# EAGLE design Adafruit BMP180 (EAGLE 6.3)
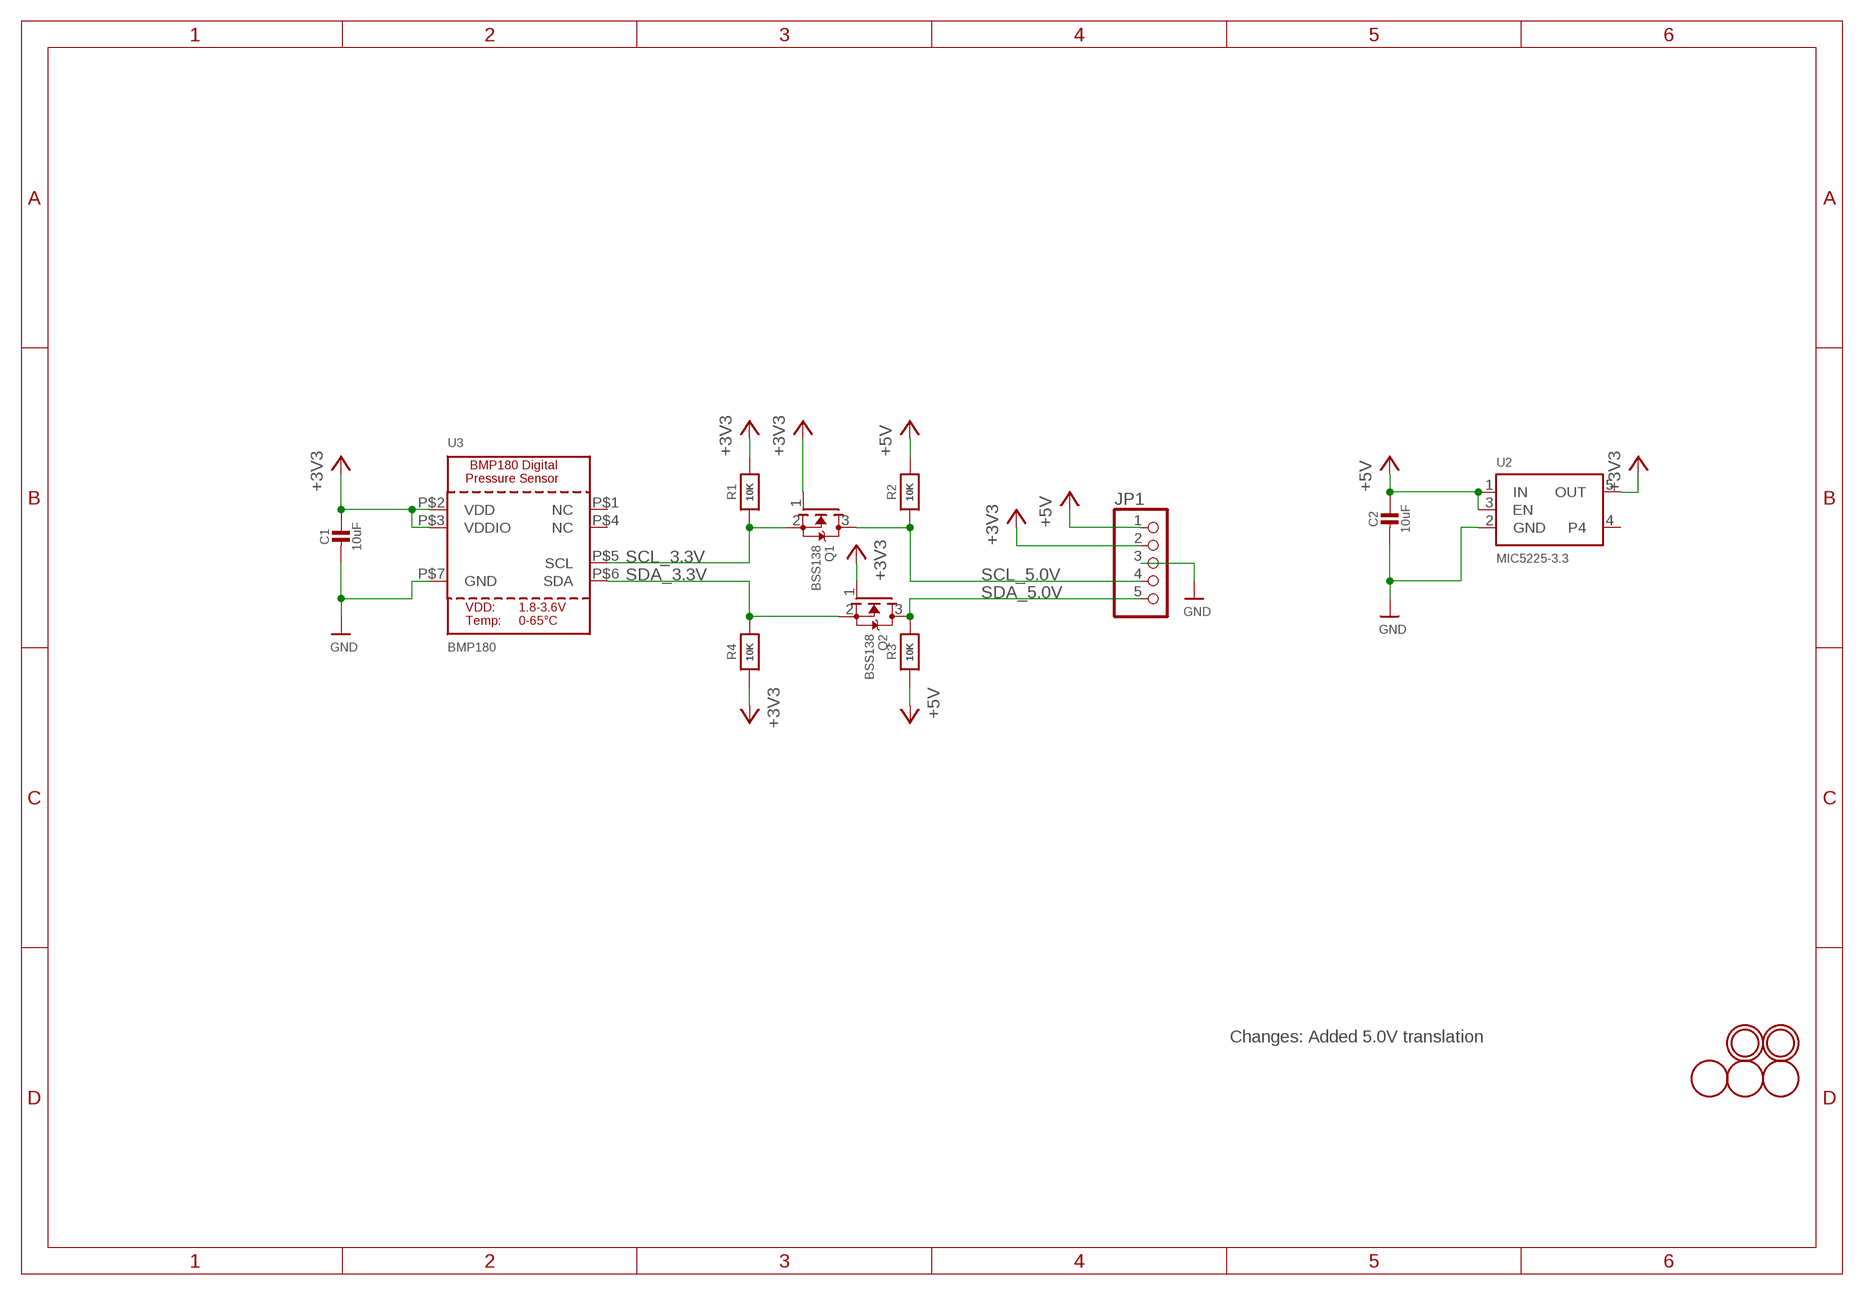
[diagram p0: schematic, sheet 1]

## Parts
C1  10uF  CAP_CERAMIC0805-NOOUTLINE  [0805-NO]
C2  10uF  CAP_CERAMIC0805-NOOUTLINE  [0805-NO]
JP1  HEADER-1X570MIL  [1X05_ROUND_70]
Q1  BSS138  MOSFET-NREFLOW  [SOT23]
Q2  BSS138  MOSFET-NREFLOW  [SOT23]
R1  10K  RESISTOR0805_NOOUTLINE  [0805-NO]
R2  10K  RESISTOR_0805MP  [_0805MP]
R3  10K  RESISTOR0805_NOOUTLINE  [0805-NO]
R4  10K  RESISTOR0805_NOOUTLINE  [0805-NO]
U2  MIC5225-3.3  VREG_SOT23-5  [SOT23-5]
U3  BMP180  BMP180EXT  [BMP180_EXTENDED]
U$1  FIDUCIAL  [FIDUCIAL_1MM]
U$5  FIDUCIAL  [FIDUCIAL_1MM]
U$7  MOUNTINGHOLE2.0  [MOUNTINGHOLE_2.0_PLATED]
U$8  MOUNTINGHOLE2.0  [MOUNTINGHOLE_2.0_PLATED]
U$15  FIDUCIAL  [FIDUCIAL_1MM]

## Nets
+3V3: C1.1 JP1.2 Q1.1(G) Q2.1(G) R1.2 R4.1 U2.5(OUT) U3.P$2(VDD) U3.P$3(VDDIO)
+5V: C2.1 JP1.1 R2.2 R3.1 U2.1(IN) U2.3(EN)
GND: C1.2 C2.2 JP1.3 U2.2(GND) U3.P$7(GND)
SCL_3.3V: Q1.2(S) R1.1 U3.P$5(SCL)
SCL_5.0V: JP1.4 Q1.3(D) R2.1
SDA_3.3V: Q2.2(S) R4.2 U3.P$6(SDA)
SDA_5.0V: JP1.5 Q2.3(D) R3.2
Unconnected: U2.4 U3.P$1(NC) U3.P$4(NC)

## Notes on the sheet
- Changes: Added 5.0V translation

## Library data of the parts
C1 C2 = microbuilder:CAP_CERAMIC: Ceramic Capacitors For new designs, use the packages preceded by an '_' character since they are more reliable: The following footprints should be used on most boards: _0402 - Standard footprint for regular board layouts _0603 - Standard footprint for regular board layouts _0805 - Standard footprint for regular board layouts _1206 - Standard footprint for regular board layouts For extremely tight-pitch boards where space is at a premium, the following 'micro-pitch' footprints can be used (smaller pads, no silkscreen outline, etc.): _0402MP - Micro-pitch footprint for very dense/compact boards _0603MP - Micro-pitch footprint for very dense/compact boards _0805MP - Micro-pitch footprint for very dense/compact boards _1206MP - Micro-pitch footprint for very dense/compact boards
JP1 = microbuilder:HEADER-1X5: PIN HEADER
Q1 Q2 = adafruit:MOSFET-N: N-Channel Mosfet 2N7002E - 60V 260mA SOT23 [Digikey: 2N7002ET1GOSTR-ND] - REEL BSH103 - 30V 850mA SOT23 [Digikey: 568-5013-1-ND]
R1-R4 = microbuilder:RESISTOR: Resistors For new designs, use the packages preceded by an '_' character since they are more reliable: The following footprints should be used on most boards: _0402 - Standard footprint for regular board layouts _0603 - Standard footprint for regular board layouts _0805 - Standard footprint for regular board layouts _1206 - Standard footprint for regular board layouts For extremely tight-pitch boards where space is at a premium, the following 'micro-pitch' footprints can be used (smaller pads, no silkscreen outline, etc.): _0402MP - Micro-pitch footprint for very dense/compact boards _0603MP - Micro-pitch footprint for very dense/compact boards _0805MP - Micro-pitch footprint for very dense/compact boards _1206MP - Micro-pitch footprint for very dense/compact boards
U2 = microbuilder:VREG_SOT23-5: SOT23-5 Fixed Voltage Regulators Part Current Out V Out V In V Dropout θJA (°C/W) TJ (°C) Digikey Part No. ADP121 150mA 3.3V 3.4-5.5V 0.09V @ 150mA -- -- ADP121-AUJZ33R7CT-ND ADP121 150mA 3.0V 3.1-5.5V 0.09V @ 150mA -- -- ADP121-AUJZ30R7CT-ND ADP122 300mA 3.3V 3.4-5.5V 0.085V @ 300mA -- -- ADP122AUJZ-3.3-R7CT-ND ADP1712 300mA 3.3V 3.5-5.5V 0.17V @ 300mA -- -- ADP1712AUJZ-3.3-R7TR-ND AP7311 (Low Cost) 150mA 3.3V 3.5-6V 0.15V @ 150mA -- -- AP7311-33WG-7DICT-ND LD39015M18R 150mA 1.8V 1.9V-5.5V 0.08V @ 100mA -- -- 497-6977-1-ND LP2985A-33DBVR 150mA 3.3V 3.3-16V 0.28V @ 150mA 206 150 296-18479-1-ND MCP1824T-3302E/OT 300mA 3.3V 3.5V-6V 0.2V @ 300mA -- -- MCP1824T-3302E/OTCT-ND MIC5205-2.5YM5 TR 150mA 2.5V 2.7-16V 0.165V @ 150mA -- -- 576-1257-2-ND MIC5205-3.0YM5 TR 150mA 3.0V 3.2V-16V 0.165V @ 150mA -- -- 576-1258-2-ND MIC5205-3.3YM5 TR 150mA 3.3V 3.5V-16V 0.165V @ 150mA -- -- 576-1259-2-ND TPS780330220 150mA 3.3V+2.2V 3.6-5.5V 250mV Max -- -- 296-23332-1-ND TDA3663/N1,135 100mA 3.3V 3.5-45V 0.18V @ 50mA -- -- 568-5343-1-ND Max operating temp can be calculated using θJA, TJ (max junction temperature), and power in watts. Set the "Maximum Ambient Temperature" until it reaches TJ ("Max Junction Temperature"), which is the absolute limit for safe use of the regulator: Heat Sink Temperature Calculator <http://www.daycounter.com/Calculators/Heat-Sink-Temperature-Calculator.phtml> For example, With 12V source into a 3.3V LP2985 and a 30mA load, we are dissipating (12V-3.3V) * 0.03A = 0.261W. With a θJA of 206 °C/W, a TJ of 150°C, and 261mW we can safely use the chip without a heat sink up to 75°C (=147.1°C Junction Temperature).
U3 = microbuilder:BMP180: BMP180 Digital Pressure Sensor 1.8-3.6V Supply, I2C Interface
U$1 U$5 U$15 = adafruit:FIDUCIAL: For use by pick and place machines to calibrate the vision/machine, 1mm By microbuilder.eu
U$7 U$8 = microbuilder:MOUNTINGHOLE: Mounting Hole For #2 screws (0.086"/2.18mm width, 0.094"/2.4mm hole) use 2.5mm; BOM: EXCLUDE

## Board
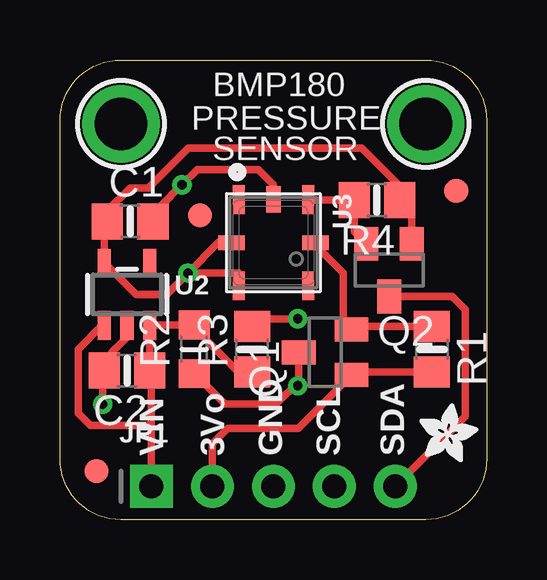
[diagram p1: board, top side]
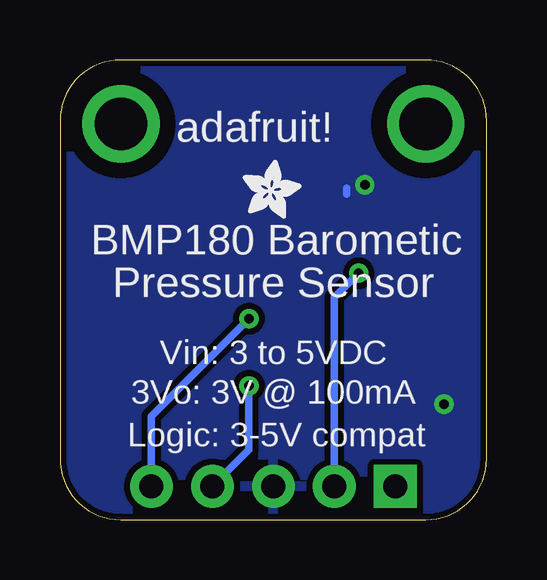
[diagram p2: board, bottom side, seen from below]

Size 17.78 x 19.18 mm. Coordinates in mm from the lower left corner, seen from the top.
Outline: 15.24,0 2.54,0 arc-90 0,2.54 0,16.64 arc-90 2.54,19.18 15.24,19.18 arc-90 17.78,16.64 17.78,2.54 arc-90 15.24,0
Copper layers (1*16): Top 0.035mm / dielectric 1.5mm / Bottom 0.035mm
Design rules "adafruit *": minimum track width 8mil, minimum drill 15.5mil, track to track 8mil, track to pad 8mil, pad to pad 8mil, via to via 8mil, smd to smd 8mil, copper to edge 10mil, drill to drill 8mil, minimum pad ring 10mil, minimum via ring 8mil, stop-mask expansion 4mil, vias tented up to drill 20mil, thermal gap 10mil

### Footprints (pad centres in the part's own frame; a part is rotated, then mirrored left to right if it is on the bottom)
0805-NO = smd 1.3 x 1.5: 1 -0.95,0; 2 0.95,0
1X05_ROUND_70 = drill 1 pad 1.778 square: 1 -5.08,0 | drill 1 pad 1.778: 2 -2.54,0; 3 0,0; 4 2.54,0; 5 5.08,0
SOT23 = smd 1 x 1.4: 1 -0.95,-1.1; 2 0.95,-1.1; 3 0,1.1
_0805MP = smd 1.2 x 1.3: 1 -1.016,0; 2 1.016,0
SOT23-5 = smd 0.55 x 1.2: 1 -0.95,-1.3; 2 0,-1.3; 3 0.95,-1.3; 4 0.95,1.3; 5 -0.95,1.3
BMP180_EXTENDED = smd 1.2 x 0.5: P$1 -1.8,-1.45; P$3 1.8,-1.45; P$4 1.8,1.45; P$6 -1.8,1.45 | smd 0.6 x 1.1: P$2 0,-1.75; P$5 0,1.75 | smd 1.1 x 0.6: P$7 -1.8,0
FIDUCIAL_1MM = smd 1 x 1: 1 0,0
MOUNTINGHOLE_2.0_PLATED = drill 2.2 pad 3: P$1 0,0

### Placement (x,y rotation side)
C1  2.92,12.45 0 top
C2  2.79,6.22 180 top
JP1  8.89,1.4 0 top
Q1  11.05,6.99 90 top
Q2  13.72,10.41 180 top
R1  15.49,7.11 270 top
R2  5.59,7.11 90 top
R3  8,7.11 90 top
R4  13.21,13.34 180 top
U2  2.79,9.4 0 top
U3  8.89,11.56 270 top
U$1  1.52,2.03 0 top
U$2  [ADAFRUIT_2.5MM]  10.16,12.57 0 bottom
U$5  5.84,12.7 0 top
U$6  [ADAFRUIT_2.5MM]  14.99,2.41 0 top
U$7  2.54,16.51 0 top
U$8  15.24,16.51 0 top
U$15  16.51,13.72 0 top

### Tracks (layer width: path | path; a pad name or v marks a point on that pad's centre or on a via)
+3V3  (via drill 0.39)
  Top 0.305: v5.33,10.29 6.6,11.56 U3.P$2 | U3.P$3 7.44,10.29 v5.33,10.29 | JP1.2 6.35,3.17 6.99,3.81 9.92,3.81 Q1.1 12.28,6.16 R1.2 | R4.1 14.67,12.83 Q2.1 | 14.22,13.4 R4.1 | v5.33,10.29 4.45,9.4 3.17,9.4 1.88,10.7 U2.5 1.84,12.45 C1.1 1.97,12.89 2.92,13.84 3.68,13.84 5.33,15.49 12.57,15.49 14.16,13.91 R4.1
  Bottom 0.305: v5.33,10.29 6.35,9.27 JP1.2
+5V
  Top 0.305: R3.1 7.94,6.22 7.37,6.22 5.59,8 R2.2 3.77,8.13 U2.3 C2.1 3.81,6.16 3.81,3.94 | 3.81,3.94 JP1.1 | U2.1 1.75,8.1 0.76,7.11 0.76,4.45 1.27,3.94 3.81,3.94
GND  (via drill 0.39)
  Top 0.305: U3.P$7 8.89,13.97 8.26,14.61 5.71,14.61 v5.08,13.97 4.19,13.08 4.19,12.45 C1.2 | U2.2 2.79,7.62 2.16,6.99 2.16,6.54 C2.2 1.78,6.16 v1.78,4.83
  Bottom 0.305: 5.84,13.84 5.84,13.59 | v1.78,4.83 1.78,4.57
  pour Bottom (isolate 0.254): 0,19.18 17.78,19.18 17.91,0 0.13,0
SCL_3.3V
  Top 0.305: R1.1 12.28,8.06 Q1.2 11.81,8.27 11.81,10.29 10.64,11.46 U3.P$5
SCL_5.0V  (via drill 0.39)
  Top 0.305: R2.1 6.86,4.83 9.02,4.83 9.95,5.76 | 9.95,5.76 Q1.3 | 9.95,5.42 9.95,5.59 | 9.95,5.59 9.95,5.76 | v9.91,5.59 9.95,5.59
  Bottom 0.305: JP1.4 9.91,2.92 v9.91,5.59
SDA_3.3V
  Top 0.305: Q2.2 12.26,12.02 R4.2 10.45,13.34 10.42,13.36 U3.P$6
SDA_5.0V  (via drill 0.39)
  Top 0.305: JP1.5 16.89,4.32 16.89,8.76 16.34,9.31 Q2.3 | R3.2 8.32,8.38 v9.91,8.38
  Bottom 0.305: v9.91,8.38 13.97,4.32 JP1.5

### Text on the board
tPlace: BMP180 | PRESSURE | SENSOR | VIN | 3Vo | GND | SCL | SDA
bPlace: adafruit! | BMP180 Barometic | Pressure Sensor | Vin: 3 to 5VDC | 3Vo: 3V @ 100mA | Logic: 3-5V compat